# EasyEDA Pro project ProPrj_数控直流电源v3_2025-11-28.epro, board PCB1（v1）
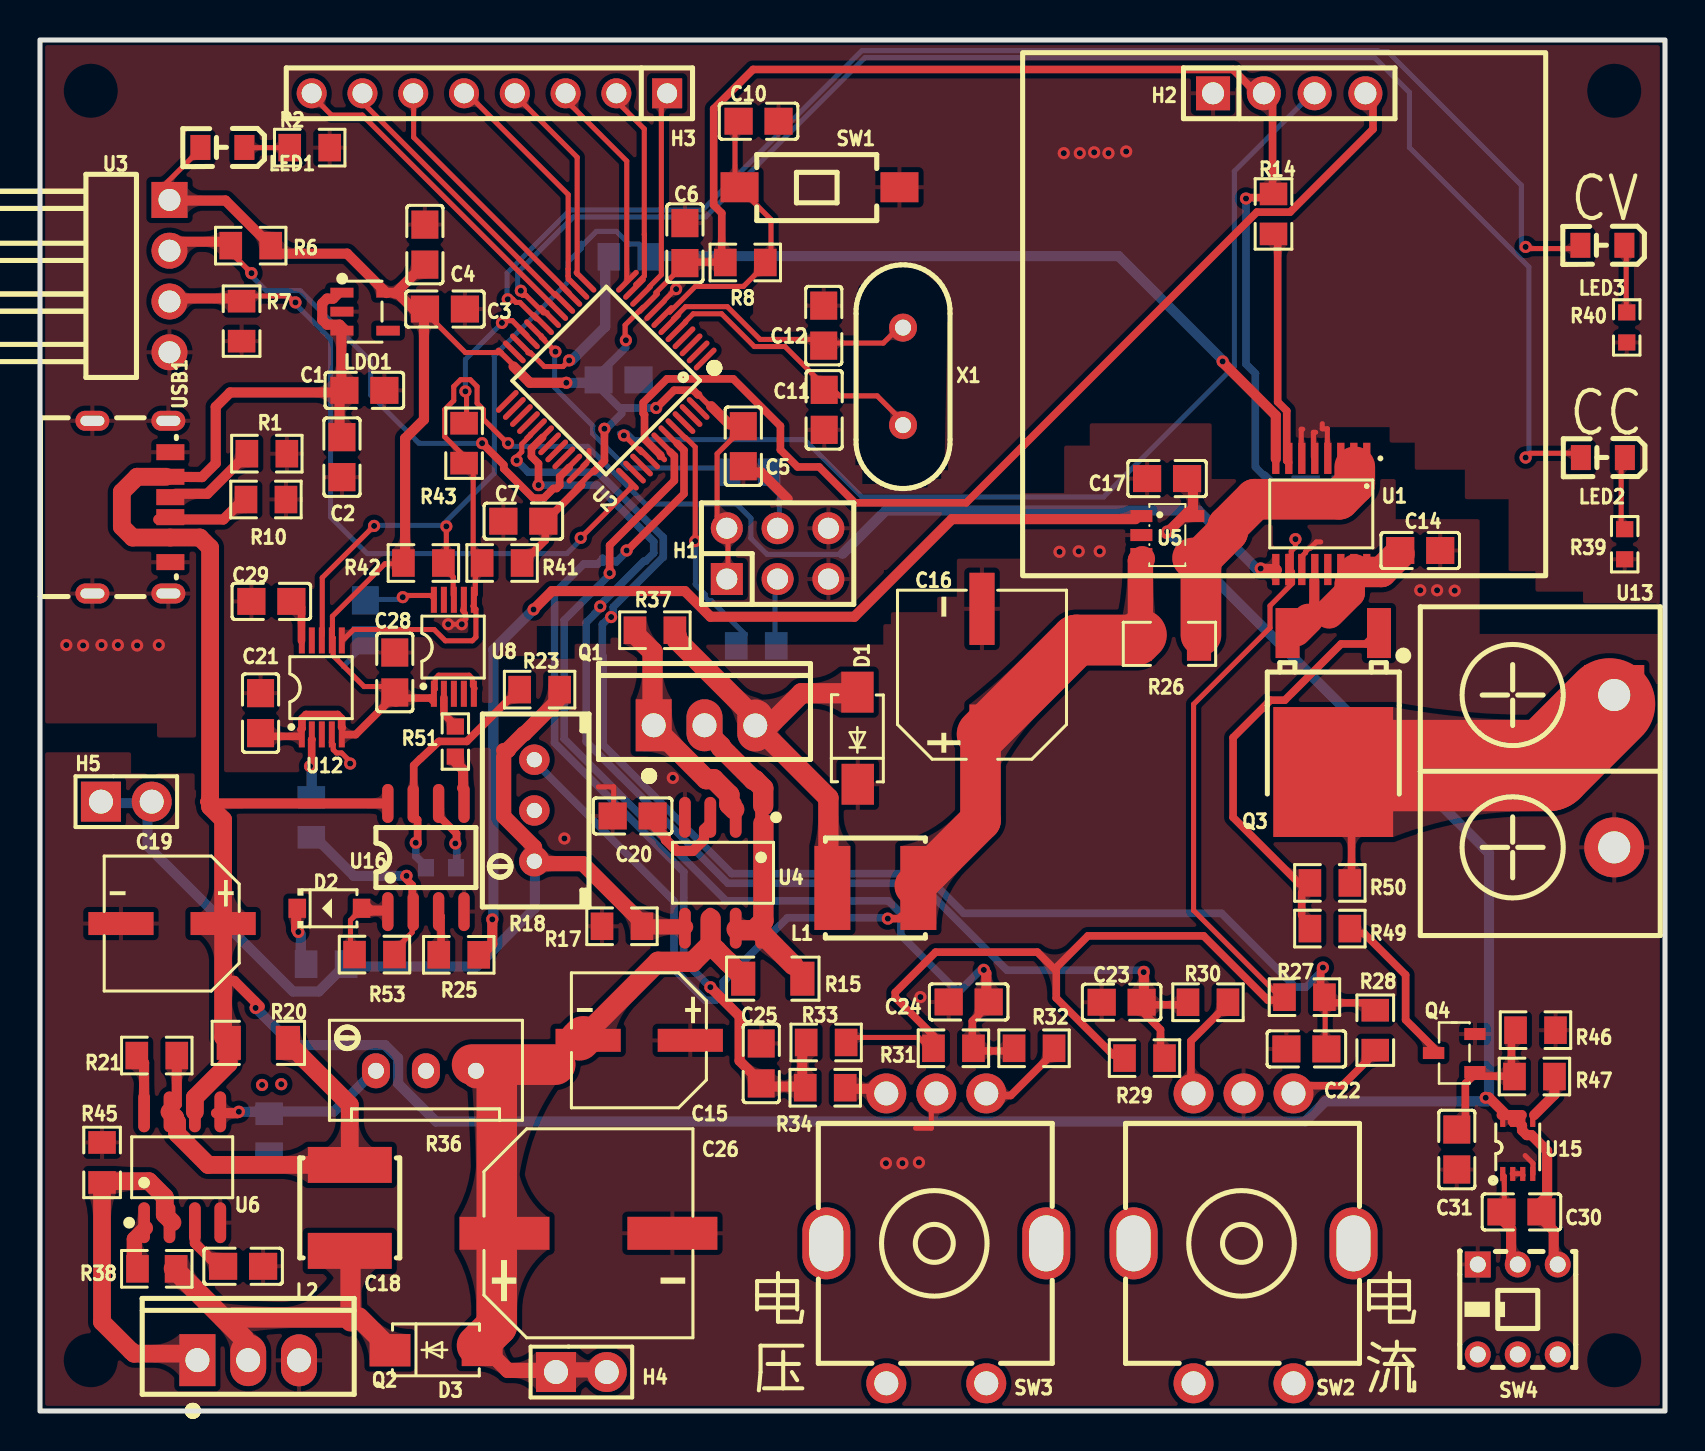
[diagram p1: board, top side]
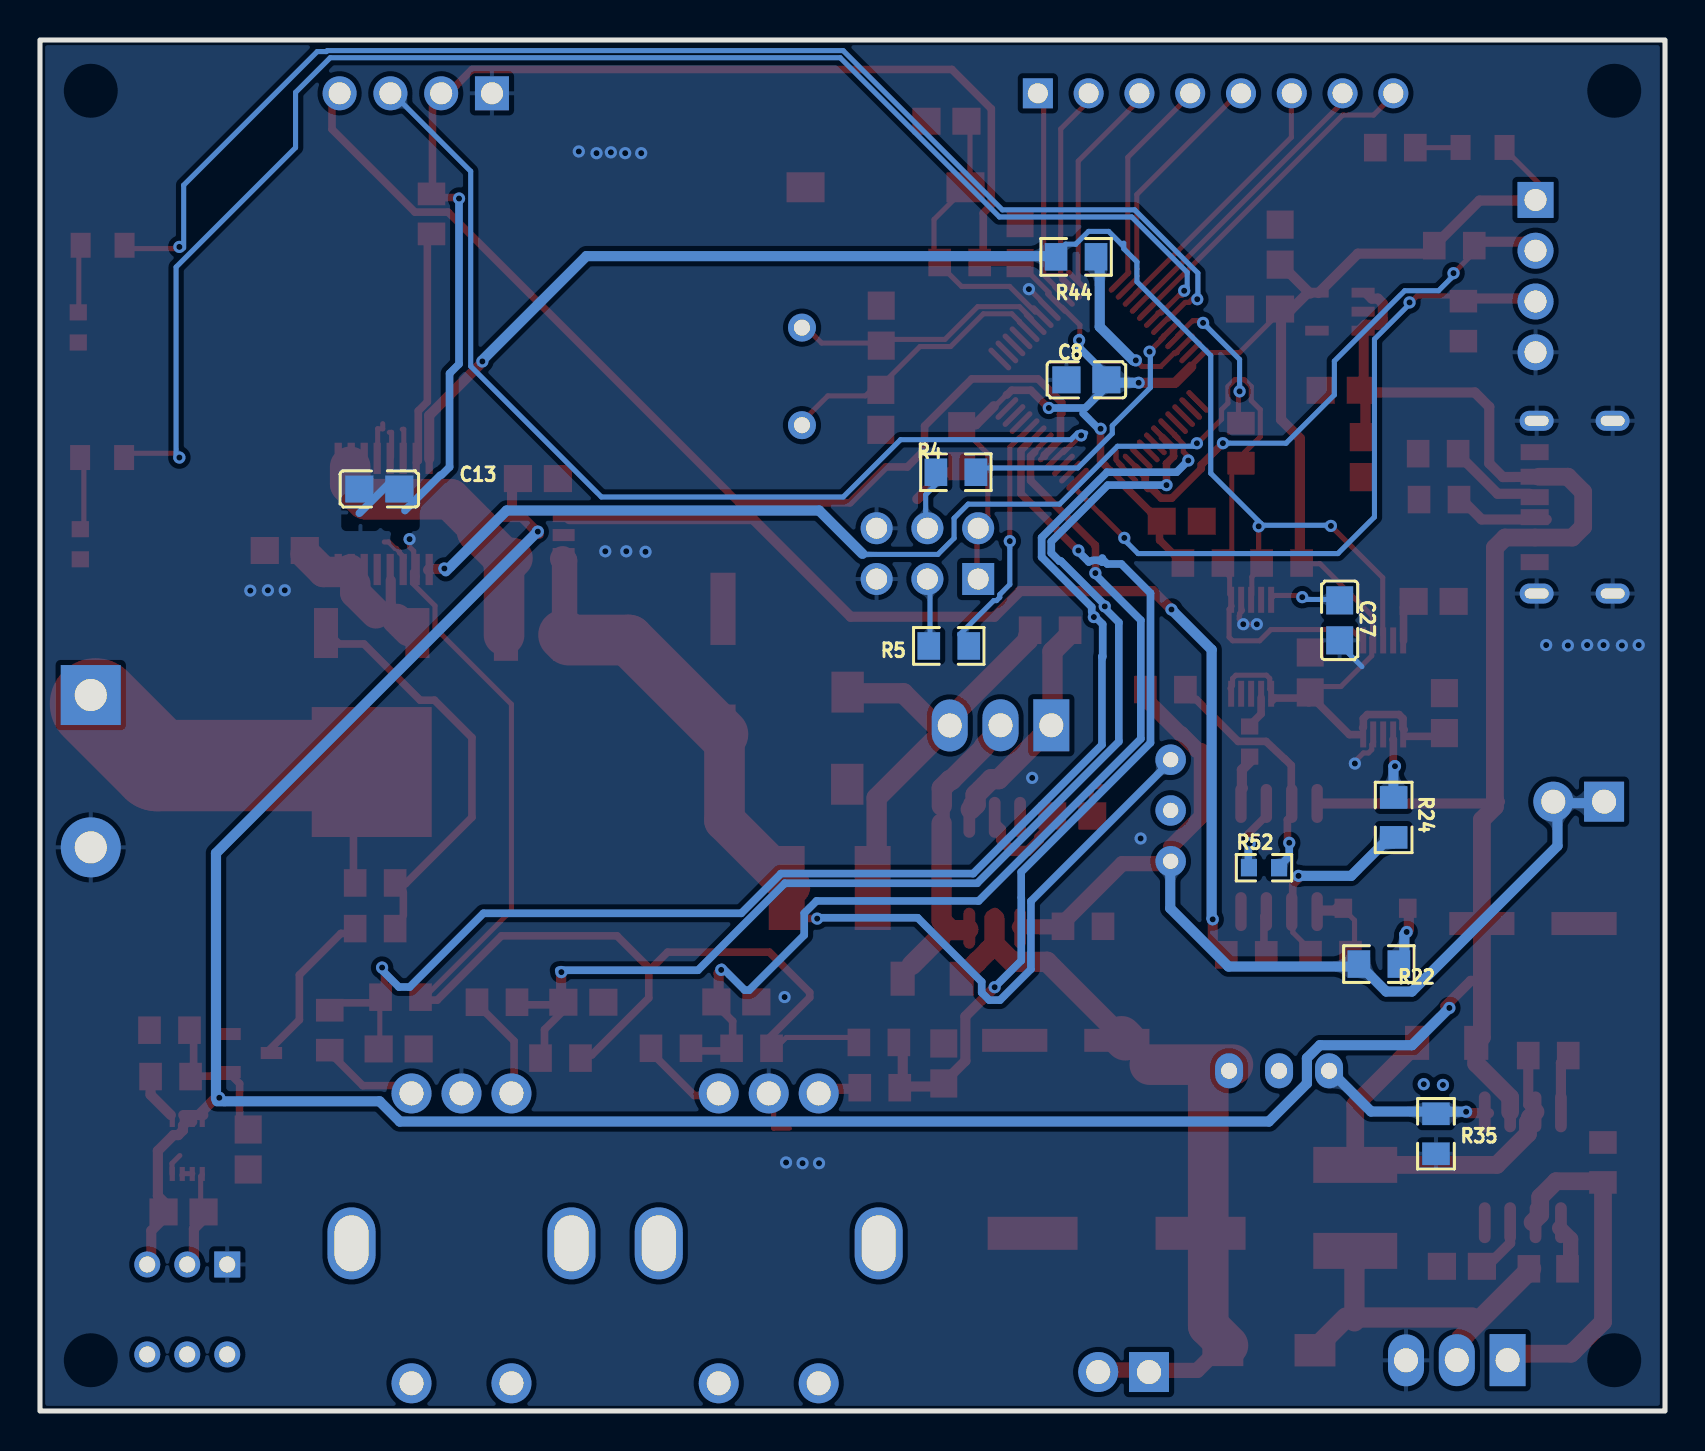
[diagram p2: board, bottom side, seen from below]

Outline 81.28 x 68.58 mm; copper layers: Top Layer, Bottom Layer. Coordinates in mm from the lower left corner of the outline.
Outline path: rectangle 0,68.58 81.28,0
Stack: Top Layer 0.035mm / Dielectric1 1.51mm FR4 er 4.5 / Bottom Layer 0.035mm

## Design rules (mm)
template: 自定义配置
spacing copperThickness1oz (default): track to track 0.102, other pairs 0.152 to 0.3
spacing copperThickness2oz: track to track 0.203, other pairs 0.152 to 0.3
track width copperThickness1oz (default): min 0.127, default 0.254, max 5.08
track width copperThickness2oz: min 0.203, default 0.762, max 2.54
track width +5V: min 0.508, default 0.508, max 2.54
differential pair differentialPair (default): width min 0.127, default 0.254, max 2.54; gap min 0.152, default 0.152
via viaSize (default): diameter min 0.5, default 0.61, max 10; hole min 0.3, default 0.305, max 6.3
net +5V uses +5V

## Placement (name value [footprint] x y rotation side)
C1  100nF  [C0805]  16.22 51.05 180 top
C2  1uF  [C0805]  15.1 47.71 90 top
C3  1uF  [C0805]  20.26 55.12 180 top
C4  100nF  [C0805]  19.25 58.34 270 top
C5  100nF  [C0805]  35.18 48.26 90 top
C6  100nF  [C0805]  32.26 58.42 270 top
C7  100nF  [C0805]  24.18 44.51 0 top
C8  100nF  [C0805]  28.94 51.58 180 bottom
C10  100nF  [C0805]  35.94 64.52 0 top
C11  22pF  [C0805]  39.22 50.08 90 top
C12  22pF  [C0805]  39.2 54.29 270 top
C13  100nF  [C0805]  64.31 46.12 180 bottom
C14  470nF  [C0805]  69.04 43.04 180 top
C15  100uF  [CAP-SMD_BD6.3-L6.6-W6.6-RD]  29.97 18.54 0 top
C16  470uF  [CAP-SMD_BD8.0-L8.3-W8.3-LS9.0-FD_H10.5]  47.12 36.83 90 top
C17  100nF  [C0805]  56.37 46.64 180 top
C18  1.5nF  [C0805]  10.16 7.24 180 top
C19  100uF  [CAP-SMD_BD6.3-L6.6-W6.6-RD]  6.6 24.38 0 top
C20  470pF  [C0805]  29.64 29.76 0 top
C21  100nF  [C0805]  11.03 34.91 270 top
C22  10nF  [C0805]  63.34 18.11 180 top
C23  10nF  [C0805]  54.1 20.45 0 top
C24  10nF  [C0805]  46.45 20.46 180 top
C25  10nF  [C0805]  36.07 17.39 270 top
C26  330uF  [CAP-SMD_BD10.0-L10.3-W10.3-FD-LS11.0_H12.0]  27.43 8.89 0 top
C27  220nF  [C0805]  16.27 39.55 90 bottom
C28  100nF  [C0805]  17.75 36.94 270 top
C29  220nF  [C0805]  11.57 40.5 0 top
C30  100nF  [C0805]  74.1 9.96 180 top
C31  100nF  [C0805]  70.87 13.08 90 top
D1  SS34  [SMA_L4.3-W2.6-LS5.0-FD]  40.89 33.66 270 top
D2  1N4148W  [SOD-123_L2.7-W1.6-LS3.7-FD]  14.48 25.15 180 top
D3  SS34  [SMA_L4.3-W2.6-LS5.0-FD]  19.81 3.05 180 top
H1  210-72-03GB01  [HDR-TH_6P-P2.54-V-R2-C3-S2.54_A2541WV-2X3P]  36.89 42.89 0 top
H2  2.54-1*4P母  [HDR-TH_4P-P2.54-V-F]  62.48 65.91 0 top
H3  PZ254V-11-08P  [HDR-TH_8P-P2.54-V-M]  22.48 65.91 180 top
H4  PZ254V-11-02P  [HDR-TH_2P-P2.54-V-M]  27.08 1.95 0 top
H5  PZ254V-11-02P  [HDR-TH_2P-P2.54-V-M]  4.32 30.48 0 top
L1  220uH  [IND-SMD_L5.0-W5.0_FNR50XXS]  41.78 26.16 180 top
L2  220uH  [IND-SMD_L5.0-W5.0_FNR50XXS]  15.49 10.16 90 top
LDO1  ME6211C33M5G-N  [SOT-23-5_L3.0-W1.7-P0.95-LS2.8-BL]  16.26 54.99 270 top
LED1  LS R976-NR-1-0-20-R18  [LED0805-RD_RED]  9.12 63.2 180 top
LED2  LS R976-NR-1-0-20-R18  [LED0805-RD_RED]  78.17 47.69 180 top
LED3  LS R976-NR-1-0-20-R18  [LED0805-RD_RED]  78.15 58.31 180 top
Q1  TIP31C  [TO-220-3_L10.0-W4.5-P2.54-L]  33.24 34.3 0 top
Q2  TIP31C  [TO-220-3_L10.0-W4.5-P2.54-L]  10.41 2.54 0 top
Q3  AOD4185  [TO-252-3_L6.6-W6.1-P4.57-LS9.9-BR-CW]  64.69 35.44 90 top
Q4  MMBT3904-E  [SOT-23-3_L2.9-W1.4-P1.90-LS2.5-BR]  70.74 17.91 0 top
R1  5.1kΩ  [R0805]  11.35 47.89 0 top
R2  1kΩ  [R0805]  13.49 63.2 0 top
R4  10kΩ  [R0805]  35.47 46.96 180 bottom
R5  10kΩ  [R0805]  35.82 38.27 0 bottom
R6  10kΩ  [R0805]  10.54 58.29 180 top
R7  10kΩ  [R0805]  10.08 54.52 90 top
R8  10kΩ  [R0805]  35.28 57.45 180 top
R10  5.1kΩ  [R0805]  11.3 45.59 0 top
R14  4.7kΩ  [R0805]  61.7 59.88 270 top
R15  220mΩ  [R1206]  36.65 21.63 0 top
R17  10kΩ  [R0805]  29.11 24.25 0 top
R18  100kΩ  [RES-ADJ-TH_3296W]  24.73 30.04 180 top
R20  220mΩ  [R1206]  10.92 18.42 180 top
R21  180Ω  [R0805]  5.84 17.78 0 top
R22  1kΩ  [R0805]  14.31 22.36 180 bottom
R23  100kΩ  [R0805]  24.99 36.08 0 top
R24  1kΩ  [R0805]  13.57 29.69 270 bottom
R25  1kΩ  [R0805]  20.95 22.82 180 top
R26  50mΩ  [R1206]  56.49 38.38 0 top
R27  10kΩ  [R0805]  63.25 20.7 0 top
R28  10kΩ  [R0805]  66.79 19.05 270 top
R29  10kΩ  [R0805]  55.25 17.65 0 top
R30  10kΩ  [R0805]  58.42 20.45 0 top
R31  10kΩ  [R0805]  45.69 18.14 0 top
R32  10kΩ  [R0805]  49.72 18.14 0 top
R33  10kΩ  [R0805]  39.32 18.44 180 top
R34  10kΩ  [R0805]  39.28 16.17 0 top
R35  10kΩ  [R0805]  11.46 13.87 90 bottom
R36  100kΩ  [RES-ADJ-TH_3296W-1-203]  19.3 17.02 180 top
R37  100Ω  [R0805]  30.76 39.06 180 top
R38  10Ω  [R0805_NEW]  5.84 7.11 0 top
R39  1kΩ  [R0603]  79.26 43.36 270 top
R40  1kΩ  [R0603]  79.37 54.2 270 top
R41  10kΩ  [R0805]  23.11 42.42 180 top
R42  10kΩ  [R0805]  19.18 42.42 0 top
R43  100Ω  [R0805]  21.21 48.41 90 top
R44  100Ω  [R0805]  29.46 57.73 180 bottom
R45  180Ω  [R0805]  3.11 12.43 90 top
R46  510Ω  [R0805]  74.8 19.05 180 top
R47  1kΩ  [R0805]  74.75 16.73 180 top
R49  1kΩ  [R0805]  64.52 24.13 180 top
R50  10kΩ  [R0805]  64.52 26.42 0 top
R51  1kΩ  [R0603]  20.78 33.49 270 top
R52  1kΩ  [R0603]  20.06 27.18 180 bottom
R53  1kΩ  [R0805]  16.73 22.83 180 top
SW1  TS-1101-C-W  [SW-SMD_L6.0-W3.3-LS8.0]  38.99 61.21 0 top
SW2  EC11N1525404  [SW-TH_EC11NXXXX]  60.2 8.64 180 top
SW3  EC11N1525404  [SW-TH_EC11NXXXX]  44.83 8.64 180 top
SW4  5.8 WSPT  [SW-TH_6P-L5.8-W5.8-P2.00-LS4.5-TL_K8-5851E-L1]  73.91 5.08 0 top
U1  INA260AIPWR  [TSSOP-16_L5.0-W4.4-P0.65-LS6.4-BL-1]  64.09 44.87 180 top
U2  STM32F103C8T6  [LQFP-48_L7.0-W7.0-P0.50-LS9.0-BL]  28.32 51.56 135 top
U3  2541WR-04P  [HDR-TH_4P-P2.54-H-M-W10.4-N]  6.48 56.77 270 top
U4  MC34063ADR  [SOIC-8_L4.9-W3.9-P1.27-LS6.0-BL]  34.16 26.92 180 top
U5  INA180A3IDBVR  [SOT-23-5_L3.0-W1.7-P0.95-LS2.8-BR]  56.39 43.82 180 top
U6  MC34063ADR  [SOIC-8_L4.9-W3.9-P1.27-LS6.0-BL]  7.11 12.19 0 top
U8  DAC60501MDGSR  [VSSOP-10_L3.0-W3.0-P0.50-LS4.9-BL]  20.7 38.23 0 top
U12  DAC60501MDGSR  [VSSOP-10_L3.0-W3.0-P0.50-LS4.9-BL]  14.1 36.2 0 top
U13  KF7.62-2P  [CONN-TH_KF7.62-2P]  78.74 32 270 top
U15  SN74LVC1G74DCUR  [SSOP-8_L2.0-W2.3-P0.50-LS3.1-BR]  73.91 13.21 270 top
U16  LM358DR  [SOIC-8_L5.0-W4.0-P1.27-LS6.0-BL]  19.3 27.69 0 top
USB1  UKDBBTAAA  [USB-C-SMD]  4.57 45.21 270 top
X1  8MHz  [CRYSTAL-TH_L11.1-W4.7-P4.88]  43.17 51.75 270 top

## Footprints (pads in the part's own frame, mm; a bottom-side part is the same pattern mirrored in y, then rotated)
C0805
  rect 1.41x1.35 smd: 1(-1,0) 2(1,0)
CAP-SMD_BD6.3-L6.6-W6.6-RD
  rect 3.26x1.15 smd: 1(2.555,0) 2(-2.555,0)
CAP-SMD_BD8.0-L8.3-W8.3-LS9.0-FD_H10.5
  rect 3.61x1.26 smd: 1(-3.295,0) 2(3.295,0)
CAP-SMD_BD10.0-L10.3-W10.3-FD-LS11.0_H12.0
  rect 4.5x1.65 smd: 1(-4.2,0) 2(4.2,0)
CONN-TH_KF7.62-2P
  rect 3x3 hole 1.6: 1(-3.81,0)
  round 3 hole 1.6: 2(3.81,0)
CRYSTAL-TH_L11.1-W4.7-P4.88
  round 1.4 hole 0.8: 1(-2.44,0) 2(2.44,0)
HDR-TH_2P-P2.54-V-M
  rect 2x2 hole 1.2: 1(-1.27,0)
  round 2 hole 1.2: 2(1.27,0)
HDR-TH_4P-P2.54-H-M-W10.4-N
  rect 1.8x1.8 hole 1.1: 1(-3.81,0)
  round 1.8 hole 1.1: 2(-1.27,0) 3(1.27,0) 4(3.81,0)
HDR-TH_4P-P2.54-V-F
  rect 1.7x1.7 hole 1.1: 1(-3.81,0)
  round 1.7 hole 1.1: 2(-1.27,0) 3(1.27,0) 4(3.81,0)
HDR-TH_6P-P2.54-V-R2-C3-S2.54_A2541WV-2X3P
  rect 1.6x1.6 hole 1.05: 1(-2.54,-1.27)
  round 1.6 hole 1.05: 2(-2.54,1.27) 3(0,-1.27) 4(0,1.27) 5(2.54,-1.27) 6(2.54,1.27)
HDR-TH_8P-P2.54-V-M
  rect 1.5x1.5 hole 1: 1(-8.89,0)
  round 1.5 hole 1: 2(-6.35,0) 3(-3.81,0) 4(-1.27,0) 5(1.27,0) 6(3.81,0) 7(6.35,0) 8(8.89,0)
IND-SMD_L5.0-W5.0_FNR50XXS
  rect 1.8x4.2 smd: 1(-2.15,0) 2(2.15,0)
LED0805-RD_RED
  rect 1x1.25 smd: 1(-1.1,0) 2(1.1,0)
LQFP-48_L7.0-W7.0-P0.50-LS9.0-BL
  oval 0.27x1.5 smd: 1(-2.75,-4.25) 2(-2.25,-4.25) 3(-1.75,-4.25) 4(-1.25,-4.25) 5(-0.75,-4.25) 6(-0.25,-4.25) 7(0.25,-4.25) 8(0.75,-4.25) 9(1.25,-4.25) 10(1.75,-4.25) 11(2.25,-4.25) 12(2.75,-4.25) 25(2.75,4.25) 26(2.25,4.25) 27(1.75,4.25) 28(1.25,4.25) 29(0.75,4.25) 30(0.25,4.25) 31(-0.25,4.25) 32(-0.75,4.25) 33(-1.25,4.25) 34(-1.75,4.25) 35(-2.25,4.25) 36(-2.75,4.25)
  oval 1.5x0.27 smd: 13(4.25,-2.75) 14(4.25,-2.25) 15(4.25,-1.75) 16(4.25,-1.25) 17(4.25,-0.75) 18(4.25,-0.25) 19(4.25,0.25) 20(4.25,0.75) 21(4.25,1.25) 22(4.25,1.75) 23(4.25,2.25) 24(4.25,2.75) 37(-4.25,2.75) 38(-4.25,2.25) 39(-4.25,1.75) 40(-4.25,1.25) 41(-4.25,0.75) 42(-4.25,0.25) 43(-4.25,-0.25) 44(-4.25,-0.75) 45(-4.25,-1.25) 46(-4.25,-1.75) 47(-4.25,-2.25) 48(-4.25,-2.75)
R0603
  rect 0.806x0.864 smd: 1(-0.753,0) 2(0.753,0)
R0805
  rect 1.133x1.377 smd: 1(-1,0) 2(1,0)
R0805_NEW
  rect 1.133x1.377 smd: 1(-0.966,0) 2(0.966,0)
R1206
  rect 1.208x1.701 smd: 1(-1.479,0) 2(1.479,0)
RES-ADJ-TH_3296W
  round 1.524 hole 0.762: 1(0,2.54) 2(0,0) 3(0,-2.54)
RES-ADJ-TH_3296W-1-203
  oval 1.4x1.75 hole 0.8: 1(-2.5,0) 2(0,0) 3(2.5,0)
SMA_L4.3-W2.6-LS5.0-FD
  rect 2.046x1.62 smd: 1(-2.304,-0.009) 2(2.304,0.009)
SOD-123_L2.7-W1.6-LS3.7-FD
  rect 0.88x0.96 smd: 1(-1.61,0) 2(1.61,0)
SOIC-8_L4.9-W3.9-P1.27-LS6.0-BL
  oval 0.588x2.045 smd: 1(-1.905,-2.772) 2(-0.635,-2.772) 3(0.635,-2.772) 4(1.905,-2.772) 5(1.905,2.772) 6(0.635,2.772) 7(-0.635,2.772) 8(-1.905,2.772)
SOIC-8_L5.0-W4.0-P1.27-LS6.0-BL
  oval 0.569x1.95 smd: 1(-1.905,-2.705) 2(-0.635,-2.705) 3(0.635,-2.705) 4(1.905,-2.705) 5(1.905,2.705) 6(0.635,2.705) 7(-0.635,2.705) 8(-1.905,2.705)
SOT-23-3_L2.9-W1.4-P1.90-LS2.5-BR
  rect 1.07x0.6 smd: 1(1.035,-0.95) 2(1.035,0.95) 3(-1.035,0)
SOT-23-5_L3.0-W1.7-P0.95-LS2.8-BL
  rect 0.49x1.157 smd: 1(-0.95,-1.153) 2(0,-1.153) 3(0.95,-1.153)
  rect 0.49x1.175 smd: 4(0.95,1.153) 5(-0.95,1.153)
SOT-23-5_L3.0-W1.7-P0.95-LS2.8-BR
  rect 1.1x0.6 smd: 1(1.3,-0.95) 2(1.3,0) 3(1.3,0.95) 4(-1.3,0.95) 5(-1.3,-0.95)
SSOP-8_L2.0-W2.3-P0.50-LS3.1-BR
  rect 0.7x0.26 smd: 1(1.35,-0.75) 2(1.35,-0.25) 3(1.35,0.25) 4(1.35,0.75) 5(-1.35,0.75) 6(-1.35,0.25) 7(-1.35,-0.25) 8(-1.35,-0.75)
SW-SMD_L6.0-W3.3-LS8.0
  rect 1.9x1.5 smd: 1(-4,0) 2(4,0)
SW-TH_6P-L5.8-W5.8-P2.00-LS4.5-TL_K8-5851E-L1
  rect 1.3x1.3 hole 0.8: 1(-2,2.25)
  round 1.3 hole 0.8: 2(0,2.25) 3(2,2.25) 4(-2,-2.25) 5(0,-2.25) 6(2,-2.25)
SW-TH_EC11NXXXX
  round 2 hole 1.2: A(-2.5,-7.25) B(2.5,-7.25) C(0,-7.25) D(-2.5,7.25) E(2.5,7.25)
  oval 2.4x3.6 hole 1.7x2.8: EH(-5.5,0.25) EH(5.5,0.25)
TO-220-3_L10.0-W4.5-P2.54-L
  rect 1.8x2.6 hole 1.2: 1(-2.54,0.005)
  oval 1.8x2.6 hole 1.2: 2(0,0.005) 3(2.54,-0.005)
TO-252-3_L6.6-W6.1-P4.57-LS9.9-BR-CW
  rect 2.5x1.2 smd: 1(3.475,-2.286) 3(3.475,2.286)
  rect 6.5x6 smd: 2(-3.475,0)
TSSOP-16_L5.0-W4.4-P0.65-LS6.4-BL-1
  rect 0.364x1.56 smd: 1(-2.275,-2.78) 2(-1.625,-2.78) 3(-0.975,-2.78) 4(-0.325,-2.78) 5(0.325,-2.78) 6(0.975,-2.78) 7(1.625,-2.78) 8(2.275,-2.78) 9(2.275,2.78) 10(1.625,2.78) 11(0.975,2.78) 12(0.325,2.78) 13(-0.325,2.78) 14(-0.975,2.78) 15(-1.625,2.78) 16(-2.275,2.78)
USB-C-SMD
  oval 1x1.7 hole 0.5x1.2: 1(-4.32,1.849) 2(-4.32,-1.951) 3(4.32,-1.951) 4(4.32,1.849)
  rect 0.8x1.4 smd: A5(-0.5,1.947) A9(1.52,1.948) A12(2.75,1.949) B5(0.5,1.947) B9(-1.52,1.951) B12(-2.75,1.949)
VSSOP-10_L3.0-W3.0-P0.50-LS4.9-BL
  rect 0.3x1.3 smd: 1(-1,-2.35) 2(-0.5,-2.35) 3(0,-2.35) 4(0.5,-2.35) 5(1,-2.35) 6(1,2.35) 7(0.5,2.35) 8(0,2.35) 9(-0.5,2.35) 10(-1,2.35)

## Nets
+5V: C1.2 C2.2 C17.1 C19.1 C30.1 LDO1.1 LDO1.3 R20.2 SW4.3 U5.5 U6.6 U15.6 U15.7 U15.8 U16.8 USB1.A9 USB1.B9
GND: C1.1 C2.1 C3.1 C4.1 C5.1 C6.1 C7.1 C8.1 C10.2 C11.1 C12.1 C13.1 C14.1 C15.1 C16.2 C17.2 C18.1 C19.2 C20.1 C21.1 C22.2 C23.1 C24.2 C25.1 C26.2 C27.1 C28.1 C29.1 C31.1 D1.2 H1.5 H1.6 H2.1 LDO1.2 Q2.3 Q4.2 R1.2 R2.2 R7.1 R10.2 R17.1 R35.1 R39.2 R40.2 R45.2 R46.1 SW1.2 SW2.C SW3.C SW4.1 U1.4 U1.5 U1.6 U1.11 U2.8 U2.23 U2.35 U2.47 U3.4 U4.4 U5.2 U6.4 U8.4 U8.7 U12.4 U13.2 U15.4 U16.4 USB1.1 USB1.2 USB1.3 USB1.4 USB1.A12 USB1.B12
VBAT: U2.1
VCC: C3.2 C4.2 C5.2 C6.2 C7.2 C8.2 C13.2 C21.2 C28.2 H1.1 H1.2 H2.2 LDO1.5 LED1.2 R6.1 R8.2 R14.1 R27.1 R29.1 R31.1 R33.1 R41.1 R42.1 U1.10 U2.9 U2.24 U2.36 U2.48 U3.1 U8.1 U8.5 U12.1 U12.5 U12.7
VIN: C15.2 C26.1 D3.1 H4.1 H4.2 R15.1 R36.1 U4.6
BOOT0: R5.1 U2.44
BOOT1: R4.2 U2.20
DAC-IOUT: R24.1 U12.2
DAC-VOUT: R51.1 U8.2
DAC-VOUT1: R23.1 R52.2 U16.7
I-FB: H5.1 H5.2 R17.2 R18.1 R22.1 R23.2 U4.5
I-VOUT: R25.1 U5.1
IN+: R26.2 U1.1 U1.2 U1.3 U5.4
IN-: C14.2 Q3.3 U1.12 U1.14 U1.15 U1.16
LODA+: Q3.2 R50.2 U13.1
OSCIN: C11.2 U2.5 X1.2
OSCOUT: C12.2 U2.6 X1.1
PA0: H3.1 U2.10
PA1: H3.2 U2.11
PA2: H3.3 U2.12
PA3: H3.4 U2.13
PA4: H3.5 U2.14
PA5: H3.6 U2.15
PA6: H3.7 U2.16
PA7: H3.8 U2.17
PA8: C22.1 R27.2 R28.1 U2.29
PA9: C23.2 R29.2 R30.1 U2.30
PA10: U2.31
PA11: U2.32
PA12: U2.33
PA15: U2.38
PB0: LED2.2 U2.18
PB1: LED3.2 U2.19
PB3: U2.39
PB4: H2.3 U2.40
PB5: H2.4 U2.41
PB6: C24.1 R31.2 R32.1 U2.42
PB7: C25.2 R33.2 R34.1 U2.43
PB8: U2.45
PB9: U2.46
PB10: R43.2 U2.21
PB11: R44.2 U2.22
PB12: U2.25
PB13: U2.26
PB14: U2.27
PB15: U2.28
PC13: U2.2
PC14: U2.3
PC15: U2.4
PMOS-G: Q4.3 R49.1
RESET: C10.1 R8.1 SW1.1 U2.7
SCL2: R41.2 R43.1 U1.9 U8.6 U12.6
SDA2: R42.2 R44.1 U1.8 U8.8 U12.8
STEP-DOWN1: Q1.2 R15.2 U4.1 U4.7 U4.8
SWCLK: R7.2 U2.37 U3.3
SWDIO: R6.2 U2.34 U3.2
VOUT: C16.1 L1.1 R18.3 R26.1 U5.3
$1N3381: R1.1 USB1.A5
$1N3384: R10.1 USB1.B5
$1N3407: LED1.1 R2.1
$1N3468: H1.4 R4.1
$1N3483: H1.3 R5.2
$1N3763: R14.2 U1.7
$1N5169: D1.1 L1.2 Q1.3 R37.1
$1N12640: R21.1 U6.8
$1N14143: C20.2 U4.3
$1N14411: D2.1 R53.2 U16.1
$1N14439: D2.2 R22.2
$1N14584: R25.2 U16.3
$1N14642: R24.2 R53.1 U16.2
$1N15295: Q2.1 R45.1 U6.2
$1N15305: C18.2 U6.3
$1N19205: R30.2 SW2.B
$1N19210: R28.2 SW2.A
$1N19642: R34.2 SW3.B
$1N19652: R32.2 SW3.A
$1N21463: L2.2 R20.1 R21.2 U6.7
$1N21716: R35.2 R36.3 U6.5
$1N21810: C27.2 U8.10
$1N23905: C29.2 U12.10
$1N26107: Q1.1 R37.2 U4.2
$1N26297: R38.1 U6.1
$1N26304: D3.2 L2.1 Q2.2 R38.2
$1N36216: LED2.1 R39.1
$1N36298: LED3.1 R40.1
$1N60568: C30.2 SW4.2 U15.1
$1N60719: U15.2 U15.3
$1N64537: R47.1 U15.5
$1N64545: C31.2 Q4.1 R46.2 R47.2
$1N64943: Q3.1 R49.2 R50.1
$1N65373: R51.2 U16.5
$1N65377: R52.1 U16.6

Pads without a net: LDO1 4; R18 2; R36 2; SW2 D E EH; SW3 D E EH; SW4 4 5 6; U1 13; U8 3 9; U12 3 9

## Via types
v1: diameter 0.61, hole 0.305, Top Layer to Bottom Layer, 77 vias

## Routing (per net, layer and track width the routed paths; a pad name or vN(x,y) marks a point on that pad's centre or on a via; arc(x,y) is an arc through that point)
+5V: length 184.6
  Top Layer w0.508: U16.8 8.76,30.39 8.51,30.64 ; 72.27,15.69 72.46,15.69 73.34,14.81 ; 74.91,9.82 75.71,9.02 75.71,7.19 ; 57.67,44.87 57.67,46.15 57.31,46.51 ; 15.07,50.94 15.07,50.95 ; 14.98,49.05 14.98,50.94 14.99,50.95 ; 14.99,50.95 9.51,50.95 8.79,50.23 8.79,47.4 8.11,46.72 6.31,46.73 ; 14.99,50.95 15.07,51.03 ; 11,20.24 9.72,21.51 9.17,21.51 ; 15.07,51.03 15.07,54.06 15.04,54.08 ; 15.27,54.06 14.99,54.34 14.36,54.34 14.12,54.58 14.12,55.4 14.36,55.64 14.66,55.64 14.9,55.88 ; 74.11,14.8 73.11,14.8 ; 8.51,30.23 8.25,30.48 ; 56.32,43.87 57.43,44.98 57.45,44.98 ; 74.97,10.34 75.38,10.76 75.38,13.02 74.6,13.8 74.37,13.8 74.13,14.04 74.13,14.27 73.93,14.47 73.66,14.47
  Top Layer w0.889: U6.6 7.75,15.68 9.44,17.38 R20.2 9.16,18.7 C19.1 9.16,29.58 8.51,30.23 8.51,43.18 8,43.69 USB1.A9 4.63,43.69 4.09,44.23 4.09,45.97 4.86,46.73 6.31,46.73
  Bottom Layer w0.508: 72.48,15.61 72.48,27.9 56.41,43.97 ; 10.84,20.11 12.65,18.3 17.26,18.3 17.91,17.65 17.91,16.39 19.81,14.48 63.28,14.48 64.29,15.49 72.42,15.49
  vias: v1(10.79,20.16) v1(56.38,43.99) v1(72.31,15.67)
GND: length 22.1
  Top Layer w0.254: 27.46,48.05 27.46,47.58 27.15,47.27 ; 74.29,12.78 74.68,12.39 74.68,11.85 ; 31.27,55.6 31.75,56.08 31.76,56.08 ; 27.93,31.22 28.69,31.22 28.69,30.44 ; 63.69,47.71 63.69,48.95 63.81,48.95 ; 64.06,43.47 63.84,43.47 63.52,43.15 63.46,43.15 63.3,42.99 63.3,42.93 63.06,42.69 ; 43.79,14.15 44.58,14.15 44.58,15.39 ; v1(20.42,39.36) 21.03,39.36 21.3,39.62 21.3,39.79 21.27,39.81 21.27,39.9 21.18,39.99 ; 14.58,33.52 14.58,33.43 14.67,33.34 14.67,33.08 14.83,32.92 15.09,32.92 15.62,32.39 ; 21.17,40.19 21.17,40.02 21.18,39.99 ; 21.18,39.99 21.13,40.05 ; 64.39,47.89 64.39,49.13 64.14,49.13 64.14,49.39 ; 63.16,49.11 63.08,49.11 63.08,48.1
  Top Layer w0.508: 37.4,45.62 36.07,46.95 35.34,46.95
  Bottom Layer w0.254: 16.43,38.3 16.22,38.3 15.16,37.23
  Bottom Layer w0.381: 65.3,44.91 63.88,46.34 63.27,46.34
  vias: v1(1.32,38.31) v1(2.16,38.29) v1(3.08,38.31) v1(3.9,38.31) v1(4.86,38.29) v1(5.94,38.31) v1(15.51,32.39) v1(21.1,39.36) v1(26.23,28.64) v1(31.65,31.67) v1(31.82,56.12) v1(42.31,12.39) v1(43.14,12.39) v1(44.04,20.71) v1(43.96,12.43) v1(50.99,42.98) v1(51.21,62.92) v1(52.01,62.92) v1(51.96,43) v1(52.73,62.96) v1(53.01,43) v1(53.44,62.92) v1(54.33,63) v1(69.04,41.05) v1(69.88,41.05) v1(70.76,41.04)
VCC: length 218.5
  Top Layer w0.254: 34.12,44.49 33.87,44.74 33.87,47.88 34.94,48.96 ; 8.1,63.14 8.04,63.14 5.85,60.95 ; 23.08,52.95 21.28,52.95 19.21,55.02 ; 34.41,43.84 34.41,41.75 34.26,41.6 ; 29.27,53.58 29.27,54.32 30.16,55.22 ; 31.89,57 31.86,57 30.81,55.94 30.81,55.83 ; 40.35,18.69 43.95,18.69 44.49,18.14 ; 21.77,36.15 21.63,36.28 21.63,36.64 21.47,36.81 19.94,36.81 19.77,36.64 19.77,36.11 19.7,36.03 ; 18,42.38 17.25,42.38 14.63,39.75 14.63,38.73 ; 62.65,41.99 62.65,41.41 61.52,40.28 61.52,39.18 57.7,35.35 57.7,25.04 62.05,20.69 ; 17.62,36.24 16.21,36.24 14.67,37.78 14.67,38.67 14.62,38.73 ; v1(62.79,43.61) 62.79,43.22 62.59,43.01 62.59,41.99
  Top Layer w0.381: 61.07,66.27 61.65,65.69 61.65,61.2 ; 61.56,60.98 61.28,60.7 60.25,60.7 ; 50.83,22.01 49.89,22.95 44.79,22.95 42.78,20.94 42.78,20.68 44.83,18.63 44.83,18.07 ; 50.83,22.01 50.83,20.66 53.68,17.81 54.04,17.81 ; 50.83,22.01 50.83,22.18 52.42,23.77 58.2,23.77 61.41,20.55 62.4,20.55 ; 62.59,41.87 62.46,41.74 ; 17.81,35.42 18.06,35.66 19.52,35.66 19.66,35.53 ; 25.41,44.64 27.09,46.32 27.09,46.36 ; 15.24,33.84 15.79,33.84 17.71,35.76 ; 23.87,42.15 25.28,43.56 25.28,44.47 ; 32.28,57.47 34.03,57.47 34.06,57.44 ; 13.04,34.08 13.1,34.14 13.1,34.64 13.31,34.84 14.89,34.84 15.09,34.64 15.09,34.2 15.12,34.17 ; 61,66.28 60.49,66.28 59.67,67.11 35.67,67.11 33.7,65.14 33.7,60.32 34.1,59.92 34.1,57.76 ; v1(28.23,49.13) 28.23,47.52 27.72,47.01 ; 30.76,50.1 31.72,51.06 32.68,51.06 32.91,50.83 32.94,50.83 ; 11.15,33.75 13.01,33.75
  Top Layer w0.508: 19.21,55.38 19.21,49.59 18.26,48.65 18.26,42.7 ; 6.5,60.55 9.28,60.55 11.16,58.66 ; 34.59,49.36 34.47,49.36 33.57,50.26 ; 17.75,55.9 18.88,57.02 19.15,57.02 ; v1(26.33,51.43) 24.5,51.43 23.69,52.25 ; 17.84,55.96 18.73,55.07 19.06,55.07 ; 11.59,57.89 15.36,57.89 17.33,55.92
  Bottom Layer w0.381: v1(60.32,60.65) 60.32,52.37 60.79,51.9 60.79,47.22 61.2,46.82 ; 28.12,51.05 28.99,50.17 ; 63.03,45.04 61.25,46.82 ; 29.11,50.17 v1(30.82,50.17) ; v1(28.23,49.13) 28.33,49.13 29.11,49.91 ; 29.29,53.69 29.29,53.18 28.01,51.9
  Bottom Layer w0.508: 27.6,51.44 27.6,51.43 v1(26.33,51.43)
  vias: v1(29.31,53.56)
VIN: length 35.6
  Top Layer w0.762: 25.28,2.03 23.4,2.03 22.45,2.98 ; 25.7,2.06 28.25,2.06 28.42,1.88
  Top Layer w1.016: 27.18,18.74 30.91,22.47 32.65,22.47 33.54,23.36 33.54,24.62 ; 35.06,21.82 34.41,22.47 34.4,22.47 33.84,23.03 33.84,23.03 33.55,23.33 33.53,23.33
  Top Layer w2.032: 26.99,18.55 27.18,18.74 ; 21.61,17.33 25.77,17.33 ; 22.85,16.33 22.85,4.27 21.86,3.28
(no net):
  vias: v1(11.11,16.31) v1(12.07,16.35)
BOOT0: length 11.2
  Top Layer w0.254: 32.29,48.7 32.77,48.22 v1(32.77,43.51)
  Bottom Layer w0.254: v1(32.77,43.51) 32.77,41.34 33.27,40.84 33.27,40.7 33.44,40.54 33.58,40.54 35.28,38.84
BOOT1: length 13.3
  Top Layer w0.254: 25.07,53.79 25.07,53.71 25.71,53.06
  Bottom Layer w0.254: 25.75,52.99 25.85,52.99 ; 34.31,47.17 29.37,47.17 27.65,48.89 27.65,49.29 25.74,51.19 25.74,52.97
  vias: v1(25.78,52.99)
DAC-IOUT: length 2.7
  Top Layer w0.381: 13.58,32.11 13.59,32.12 13.59,33.58 13.6,33.6
  Bottom Layer w0.508: 13.53,32.31 13.59,32.25 13.59,31.08
  vias: v1(13.51,32.25)
DAC-VOUT: length 1.6
  Top Layer w0.381: 20.2,35.68 20.2,34.87 20.76,34.31
DAC-VOUT1: length 10.4
  Top Layer w0.381: 18.89,28.5 18.89,29.57 18.64,29.82 ; 19.03,32.62 19.96,33.49 21.35,33.49 23.45,35.6 23.75,35.6 ; 18.69,30.85 18.69,32.3 19.02,32.63
  Bottom Layer w0.381: 18.8,28.28 18.8,27.75 19.18,27.36
  vias: v1(18.8,28.42)
I-FB: length 49
  Top Layer w0.762: 26,35.64 24.23,33.87 24.19,33.87 23.43,33.12 23.43,33.07 23.4,33.04 23.19,33.04 ; 23.19,32.73 23.19,29.74 24.73,28.21 R18.1 ; 24.87,27.38 27.15,27.38 30.31,24.22 32.29,24.22
  Bottom Layer w0.508: 15.14,22.18 13.94,20.98 12.66,20.98 5.38,28.27 5.38,30.49 ; 5.04,30.41 3.24,30.41 3.15,30.49 ; 15.41,22.23 21.84,22.23 24.75,25.15 24.75,27.5 24.66,27.59
I-VOUT: length 51.5
  Top Layer w0.508: v1(24.69,40.09) 25.61,41.02 32.25,41.02 33.54,39.73 40.73,39.73 45.62,44.61 54.81,44.61 ; 22,22.74 22.62,23.36 v1(22.62,24.59)
  Bottom Layer w0.508: v1(24.69,40.09) 22.68,38.08 22.68,24.65 v1(22.62,24.59)
IN+: length 14.3
  Top Layer w2.032: 57.65,42.67 58.07,42.25 58.07,38.8 ; 65.76,47.23 65.76,46.39 64.98,45.61 60.76,45.61 59.41,44.25 59.41,43.98 58.13,42.7 58.13,42.57
IN-: length 6.6
  Top Layer w0.508: 63.94,40.18 63.74,40.38 63.74,41.55
  Top Layer w1.524: 65.77,41.97 65.77,42.09 ; 64.48,39.9 65.51,40.93 65.51,41.37 ; 68,42.87 67.1,41.97 66.11,41.97 ; 62.83,39.01 63.44,39.62
LODA+: length 19.2
  Top Layer w0.381: 65.6,26.36 65.6,30.02
  Top Layer w4.572: 78.5,35.37 75.42,32.29 65.01,32.29 64.5,32.8
OSCIN: length 13.2
  Top Layer w0.254: 39.22,51.29 37.26,53.25 35.73,53.25 34.09,54.88 32.67,54.88 32.28,54.49 32.28,54.46 ; 43.07,49.45 43.07,49.58 41.87,50.78 39.99,50.78 39.39,51.38
OSCOUT: length 13
  Top Layer w0.254: 39.27,53.42 42.18,53.42 43.25,54.49 ; 31.68,54.63 32.29,55.24 34.38,55.24 36.01,53.6 39.3,53.6
PA0: length 10
  Top Layer w0.254: 30.49,56.24 31.08,56.83 31.08,65.64 31.3,65.86
PA1: length 10.3
  Top Layer w0.254: 29.81,56.27 29.81,56.35 30.23,56.78 30.23,58.84 30.23,58.85 30.23,64.13 28.61,65.75
PA2: length 10.6
  Top Layer w0.254: 29.35,56.58 29.35,62.52 26.04,65.83
PA3: length 10.5
  Top Layer w0.254: 23.59,65.99 26.87,62.71 26.87,56.87
PA4: length 11.7
  Top Layer w0.254: 26.42,56.61 26.42,56.77 26.41,56.78 26.41,57.12 26.42,57.13 26.42,60.85 21.15,66.12
PA5: length 13.7
  Top Layer w0.254: 26.48,55.92 18.69,63.71 18.69,66.37
PA6: length 14.6
  Top Layer w0.254: 15.95,66.32 15.95,65.64 25.8,55.79
PA7: length 16.7
  Top Layer w0.254: 13.34,66.07 14.58,64.82 16.12,64.82 25.63,55.32
PA8: length 69.3
  Top Layer w0.254: 23.77,47.65 24.1,47.98 24.1,48.37 24.54,48.81 24.54,48.87 ; 64.11,20.85 64.28,20.68 64.28,18.53
  Top Layer w0.381: 66.65,20.42 64.36,20.42 64.34,20.44 ; 64.15,22.2 64.05,22.1 64.05,20.96
  Bottom Layer w0.381: 28.13,37.7 28.16,37.74 ; 28.16,37.74 28.16,33.32 34.6,26.88 44.22,26.88 46.2,24.9 59.1,24.9 62.79,21.21 63.33,21.21 64.25,22.13 ; 28.16,37.74 28.13,37.77 28.13,39.36 28.47,39.7 ; v1(23.84,47.55) 24.43,46.96 27.91,46.96 31.18,43.69 31.18,42.72 28.67,40.21 28.67,39.96
  vias: v1(28.57,39.72) v1(64.17,22.18)
PA9: length 60.6
  Top Layer w0.381: 55.07,20.32 57.17,20.32 57.19,20.34 ; 56.04,17.27 56.04,19.08 54.9,20.22 ; v1(24.93,46.31) 24.93,47.39 24.58,47.75 24.58,48.14 25.14,48.7
  Top Layer w0.508: 54.96,20.71 55.21,20.96 55.21,22.02
  Bottom Layer w0.381: v1(24.93,46.31) 27.87,46.31 30.7,43.49 30.7,42.92 30.29,42.51 30.22,42.51 28.08,40.38 ; 28.02,40.15 27.32,39.45 27.32,33.49 34.4,26.4 44.02,26.4 48.37,22.05 55.33,22.05
  vias: v1(28.02,40.25) v1(55.2,21.95)
PB0: length 76.2
  Top Layer w0.254: 74.26,47.65 74.52,47.91 77.01,47.91 ; 25.37,54.94 25.18,54.94 24.31,55.81 24.14,55.81 23.98,55.97
  Bottom Layer w0.254: v1(24.05,56.04) 23.9,56.19 23.9,56.95 26.67,59.73 33.29,59.73 41.26,67.69 66.76,67.69 68.5,65.96 68.5,63.2 74.47,57.22 74.47,47.65
  vias: v1(74.31,47.69)
PB1: length 67.1
  Top Layer w0.254: 24.83,54.63 24.01,55.45 23.81,55.45 23.64,55.62 23.34,55.62 ; 76.84,58.32 76.66,58.14 74.31,58.14
  Bottom Layer w0.254: v1(23.4,55.61) 23.36,55.64 23.36,56.92 26.53,60.08 33.14,60.08 41.11,68.05 66.91,68.05 66.96,68 67.41,68 74.09,61.32 74.09,58.17
  vias: v1(74.31,58.23)
PB4: length 51.5
  Top Layer w0.254: 29.29,48.75 29.29,48.74 30.09,47.94
  Bottom Layer w0.254: 63.86,66.14 59.74,62.01 59.74,52.26 53.2,45.72 41.1,45.72 38.24,48.59 29.72,48.59 29.39,48.92 28.98,48.92
  vias: v1(29.2,48.8)
PB5: length 53.2
  Top Layer w0.381: 66.67,66.27 66.67,64.12 62.53,59.97 60.87,59.97 46.33,45.43 40.76,45.43 38.97,47.22 37.89,47.22 37.03,48.08 37.03,49.27 34.68,51.63 31.36,51.63 30.17,50.44 30.17,49.91 30.24,49.84 30.24,48.62 31.04,47.81 31.04,47.76 31.04,47.76
PB6: length 49.9
  Top Layer w0.381: 47.4,20.26 46.63,19.5 46.63,17.9 ; 48.63,18.07 48.58,18.01 47.09,18.01 ; v1(28.49,41.91) 28.49,43.3 31.73,46.54 31.73,47.77 31.53,47.97
  Top Layer w0.508: 47.33,20.45 47.33,21.91 47.16,22.08
  Bottom Layer w0.381: v1(28.49,41.91) 28.49,41.83 26.22,39.56 26.22,33.63 34.33,25.51 42.44,25.51 43.05,24.9 43.05,23.81 45.81,21.05 46.03,21.05 47.18,22.2
  vias: v1(47.21,22.06)
PB7: length 43.8
  Top Layer w0.381: 31.87,48.4 32.21,48.06 32.21,45.88 29.38,43.04 v1(29.34,43.04)
  Top Layer w0.508: 36.17,16.39 36.07,16.39 ; 36.09,16.42 34.99,17.51 34.99,19.74 v1(33.53,21.2) ; 38.01,16.23 36.22,16.23 ; 38.13,16.59 38.13,18.4
  Bottom Layer w0.381: v1(33.53,21.2) 32.2,22.53 32.2,25.68 ; 32.2,25.71 32.2,26.96 25.74,33.43 25.74,40.91 27.19,42.37 27.9,42.37 28.12,42.59 ; 29.26,42.91 28.82,42.47 arc(28.48,42.56) 28.15,42.46 28.15,42.67
PB10: length 7.1
  Top Layer w0.254: 21.22,51.06 21.34,50.95 21.34,49.69 ; 23.16,54.54 23.62,54.54 24.36,53.8
  Bottom Layer w0.254: v1(23.11,54.43) 21.28,52.6 21.28,51.06
  vias: v1(21.28,51)
PB11: length 8.2
  Top Layer w0.254: 26.42,52.5 26.16,52.25 25.22,52.25 24.54,52.93 24.4,52.93
  Bottom Layer w0.508: v1(26.47,52.55) 26.6,52.55 28.28,54.23 28.28,57.55
PMOS-G: length 8
  Top Layer w0.381: 65.55,23.89 66.23,23.89 68.31,21.81 68.31,19.57 69.83,18.04
RESET: length 13.7
  Top Layer w0.254: 36.56,57.5 36.56,59.6 34.76,61.4 34.76,64.31 34.59,64.48 ; 31.47,54.97 31.5,54.97 32.78,56.25 35.19,56.25 36.35,57.42
SCL2: length 68.1
  Top Layer w0.254: 21.33,47.29 21.28,47.24 ; 21.33,47.29 21.48,47.45 21.48,47.49 20.24,48.73 20.24,50.09 20.69,50.54 20.69,51.25 21.04,51.59 21.52,51.59 21.86,51.25 21.86,50.41 22.18,50.09 22.18,49.61 23.33,48.46 ; 21.33,47.29 21.67,46.95 21.67,42.92 22.07,42.51 ; 22.03,41.99 21.78,41.73 21.78,40.85 ; 15.19,38.59 15.69,39.09 19.71,39.09 20.28,38.53 21.62,38.53 21.8,38.71 21.8,40.11 21.65,40.26
  Top Layer w0.508: 61.13,42.12 61.82,42.12 61.87,42.07
  Bottom Layer w0.254: 40.17,42.85 36.37,42.85 35.56,43.66 35.56,44.66 34.85,45.36 30.28,45.36 27.39,48.26 23.56,48.26 v1(23.41,48.41)
  Bottom Layer w0.508: 40.14,42.88 42.31,45.04 57.94,45.04 60.98,42
  vias: v1(61.06,42.14)
SDA2: length 71
  Top Layer w0.254: 14.12,38.83 14.12,41.68 16.69,44.25 ; 20.12,42.46 20.32,42.67 20.32,44.37 ; 20.38,42.01 20.67,41.73 20.67,40.82
  Top Layer w0.508: 61.81,47.63 61.81,49.8 59.19,52.42
  Bottom Layer w0.254: 16.67,44.31 20.21,44.31 ; 20.21,44.31 20.21,44.4 22.72,46.91 22.72,52.79 26.41,56.49 26.41,57.48 27.07,58.14 27.07,58.42 ; 20.21,44.31 20.21,44.14 ; 20.21,44.31 20.28,44.31 ; 30.38,57.96 29.98,58.37 29.47,58.37 28.84,59 27.83,59 27.13,58.3
  Bottom Layer w0.508: 30.56,57.77 53.95,57.77 59.09,52.63
  vias: v1(16.71,44.27) v1(20.32,44.25) v1(59.15,52.5)
STEP-DOWN1: length 13.5
  Top Layer w1.016: 36.14,23.92 36.01,24.05 ; 37.68,22.31 36.18,23.81 ; 33.38,33.93 34.05,33.26 34.05,33.2 35.69,31.56 35.76,31.56 36.17,31.15 36.17,30.28 ; 34.85,24.1 34.9,24.05 35.92,24.05 ; 35.92,24.25 36.18,24.52 36.18,29.39
SWCLK: length 34.8
  Top Layer w0.254: 10.39,55.77 12.41,55.77 12.79,55.39 ; v1(27.05,43.67) 29.56,46.19 29.56,46.38
  Top Layer w0.508: 10.03,55.46 9.84,55.65 6.66,55.65
  Bottom Layer w0.254: 12.79,55.36 14.53,53.61 14.53,44.72 16.36,42.89 26.36,42.89 27.05,43.58 v1(27.05,43.67)
  vias: v1(12.78,55.45)
SWDIO: length 26.9
  Top Layer w0.254: 10.39,56.95 10.39,57.11 9.47,58.02
  Top Layer w0.381: v1(22.11,48.41) 23.2,47.33 23.2,47.14 24.67,45.67 25.2,45.67 25.68,46.15 25.84,46.15 25.99,46.3 25.99,46.73 26.47,47.2
  Top Layer w0.508: 6.69,58.15 7.03,58.49 9.51,58.49
  Bottom Layer w0.254: v1(22.11,48.41) 18.95,48.41 16.54,50.83 16.54,52.52 13.02,56.04 11.33,56.04 10.56,56.8
  vias: v1(10.58,56.92)
VOUT: length 49.6
  Top Layer w0.381: v1(42.41,24.63) 42.96,24.63 43.09,24.76
  Top Layer w1.27: 55.04,38.77 55.04,42.53 55.14,42.63
  Top Layer w2.032: 43.76,26.26 47.04,29.55 47.04,33.8
  Top Layer w2.54: 47.12,33.85 51.83,38.56 54.83,38.56 ; 55.04,38.77 55.09,38.82
  Bottom Layer w0.381: 24.84,32.38 31.72,25.5 31.72,22.1 33.26,20.55 33.8,20.55 34.18,20.93 34.18,21.47 37.38,24.67 42.27,24.67
$1N3381: length 4.3
  Top Layer w0.508: 10.26,47.77 8.37,45.88 6.77,45.88
$1N3384: length 4.6
  Top Layer w0.508: 10.11,45.54 9.17,44.6 5.92,44.6
$1N3407: length 2.3
  Top Layer w0.254: 12.68,63.19 10.37,63.19
$1N3468: length 2.7
  Bottom Layer w0.254: 36.2,46.61 36.98,45.83 36.98,44.23
$1N3483: length 3.3
  Bottom Layer w0.254: 36.76,38.27 36.76,41.41 36.68,41.49
$1N3763: length 11.9
  Top Layer w0.381: 61.91,59.08 61.91,50.48 62.36,50.02 62.36,47.54 62.46,47.44
$1N5169: length 19.1
  Top Layer w0.508: 36.14,33.96 35.84,34.26
  Top Layer w1.016: 31.87,38.73 31.87,38.56 35.49,34.93 ; 36.14,33.96 39.43,30.66 39.43,27.79 ; 36.14,33.96 36.06,33.88 ; 36.14,33.96 38.09,35.9 41.03,35.9
$1N12640: length 3
  Top Layer w0.508: U6.8 5.21,17.42 R21.1
$1N14143: length 4.4
  Top Layer w0.508: 30.68,29.32 31.3,28.7 31.3,28.57 31.86,28.01 32.65,28.01 33.21,28.57 33.21,29.09 33.55,29.43
$1N14411: length 3.7
  Top Layer w0.254: 16.12,25.14 15.53,24.55 15.53,22.78
  Top Layer w0.508: 17.34,25.03 16.52,25.03 16.35,25.2
$1N14439: length 2.6
  Top Layer w0.508: v1(12.92,23.96) 12.81,24.07 12.81,25.17
  Bottom Layer w0.508: 13.04,22.66 13.04,23.84 v1(12.92,23.96)
$1N14584: length 2.2
  Top Layer w0.381: 20.06,22.75 20.06,24.75 19.93,24.88
$1N14642: length 9.3
  Top Layer w0.254: 18.61,24.93 18.61,23.94 17.78,23.1
  Top Layer w0.381: 18.19,26.73 18.62,26.3 18.62,25.24
  Bottom Layer w0.508: 13.7,28.77 15.7,26.77 18.33,26.77
  vias: v1(18.33,26.77)
$1N15295: length 16.9
  Top Layer w0.889: 6.62,9.44 6.24,9.82 6.24,10.7 5.45,11.5 3.12,11.5 ; 3.07,11.35 3.1,11.32 3.1,4.46 4.56,2.99 4.58,2.99 4.7,2.87 7.61,2.87
$1N15305: length 2.8
  Top Layer w0.508: 9.03,7.11 7.75,8.4 U6.3
$1N19205: length 4.9
  Top Layer w0.381: 59.36,20.3 57.57,18.51 57.57,16.15
$1N19210: length 5
  Top Layer w0.381: 66.88,18.02 65.13,16.28 62.56,16.28
$1N19642: length 1.7
  Top Layer w0.508: 40.53,16.12 41.99,16.12 42.14,15.97
$1N19652: length 4
  Top Layer w0.381: 50.76,17.99 48.56,15.78 47.66,15.78
$1N21463: length 20.9
  Top Layer w0.508: R21.2 6.84,15.33 U6.7
  Top Layer w0.889: R20.1 15.49,15.32 L2.2 8.41,12.31 6.86,13.87 6.86,14.45 6.76,14.55 6.76,14.69 U6.7
$1N21716: length 8.4
  Top Layer w0.508: 8.81,14.9 9.88,14.9 v1(9.95,14.97)
  Bottom Layer w0.508: v1(9.95,14.97) 10.82,14.97 10.99,15.14 ; 11.48,14.98 14.7,14.98 16.72,17
$1N21810: length 3
  Top Layer w0.254: 18.37,40.8 19.54,40.8 19.72,40.62
  Bottom Layer w0.254: 16.46,40.6 17.92,40.6 18.03,40.71
  vias: v1(18.15,40.71)
$1N23905: length 1.9
  Top Layer w0.381: 13.08,38.53 13.08,40.2 12.91,40.38
$1N26107: length 10.5
  Top Layer w1.016: 34.72,30.09 34.48,30.34 34.48,30.82 33.69,31.61 33.32,31.61 31.11,33.82 30.94,33.82 ; 29.78,38.84 30.64,37.99 30.64,34.27
$1N26297: length 2.1
  Top Layer w0.762: 5.27,9.15 4.72,8.6 4.72,7.32
$1N26304: length 16
  Top Layer w1.016: 15.95,4.68 17.34,3.29 ; 15.29,7.57 15.53,7.32 15.53,4.68 ; 15.53,4.68 15.53,4.49 ; 15.53,4.68 9.65,4.68 ; 6.7,7.12 10.21,3.61
$1N36216: length 3.4
  Top Layer w0.254: 79.09,44.13 79.09,47.5 79.07,47.51
$1N36298: length 3.2
  Top Layer w0.254: 79.25,58.2 79.34,58.11 79.34,55.06
$1N60568: length 4.3
  Top Layer w0.254: 73.15,11.83 73.24,11.75 73.24,10.21
  Top Layer w0.508: 72.78,9.91 73.58,9.11 73.58,7.61
$1N60719: length 0.6
  Top Layer w0.254: 74.18,11.8 74.11,11.87 73.64,11.87
$1N64537: length 2.1
  Top Layer w0.508: 75.75,16.53 75.75,15.82 74.73,14.8
$1N64545: length 7
  Top Layer w0.381: 73.54,19.13 73.6,19.07 73.6,16.77 ; 73.65,16.75 71.68,16.75 ; 71.78,16.86 71.29,16.38 71.29,14.47
$1N64943: length 19.6
  Top Layer w0.381: 63.53,26.38 63,26.38 59.68,29.7 59.68,33.69 61.55,35.56 62.26,35.56 65.08,38.37 66.32,38.37 66.79,38.84 ; 63.11,24.79 63.11,25.95
$1N65373: length 1.7
  Top Layer w0.508: 21.11,31.16 21.16,31.21 21.16,32.07 20.65,32.59
$1N65377: length 2.5
  Top Layer w0.381: 20.83,28.49 20.83,28.88 19.94,29.78
  Bottom Layer w0.381: 20.84,27.42 20.84,28.28 20.83,28.3
  vias: v1(20.78,28.39)

## Copper pours and planes (outline as drawn; the poured copper is in the pictures)
GND on Top Layer: 4.56,32.95 0.24,32.95 0.24,-0.2 81.2,-0.2 81.2,38.87 72.01,38.87 72.01,44.61 67.81,44.61 67.81,46.62 58.6,46.62 58.6,49.41 52.51,49.41 52.51,48.29 51.22,48.29 51.22,45.92 49.04,45.92 49.04,42.64 45.86,42.64 45.86,40.73 44.88,40.73 44.88,39.96 42.56,39.96 42.56,39.36 42.18,39.36 42.18,38.33 33.05,38.33 33.05,38.69 28.54,38.69 28.54,38.38 26.74,38.38 26.74,37.63 24.6,37.63 24.6,34.78 23.71,34.78 23.71,34.06 24.54,34.06 24.54,33.18 20.51,33.18 20.51,33.09 17.97,33.09 17.97,31.1 7.73,31.1 7.73,31.9 4.56,31.9
GND on Top Layer: 0.01,68.62 0.01,34.4 5.86,34.4 5.86,33.69 8.88,33.69 8.88,31.95 14.47,31.95 14.47,31.25 20.12,31.25 20.12,32.98 21.79,32.98 21.79,35.42 22.65,35.42 22.65,37.76 24.85,37.76 24.85,39.27 27.18,39.27 27.18,40.95 31.59,40.95 31.59,40.91 33.18,40.91 33.18,39.63 36.91,39.63 36.91,39.45 41.83,39.45 41.83,40.61 42.22,40.61 42.22,42.07 45.13,42.07 45.13,43.82 49.03,43.82 49.03,43.74 51.37,43.74 51.37,46.33 52.89,46.33 52.89,48.53 59.17,48.53 59.17,47.73 59.94,47.73 59.94,47.27 62.02,47.27 62.02,47.02 63.08,47.02 63.08,46.85 64.25,46.85 64.25,46.96 64.45,46.96 64.45,48.62 64.51,48.62 64.51,49.22 67.5,49.22 67.5,48.44 68.76,48.44 68.76,47.08 71.27,47.08 71.27,45.61 73.45,45.61 73.45,42.01 74.8,42.01 74.8,40.98 77.18,40.98 77.18,40.4 80.84,40.4 80.84,40.15 81.1,40.15 81.1,68.35 81.27,68.35 81.27,68.62
GND on Bottom Layer: -7.76,75.16 -7.76,-8.97 84.76,-8.97 84.76,-6.65 88.81,-6.65 88.81,75.16

Small or netless copper shapes (teardrops, artwork), in the pictures only: 285 on Top Layer, 70 on Bottom Layer

## Text on the board
Top Silkscreen Layer: CC | CV | 电 / 压 | 电 / 流
